# EAGLE schematic 4 Strain Gauge Board (EAGLE 9.1.3)
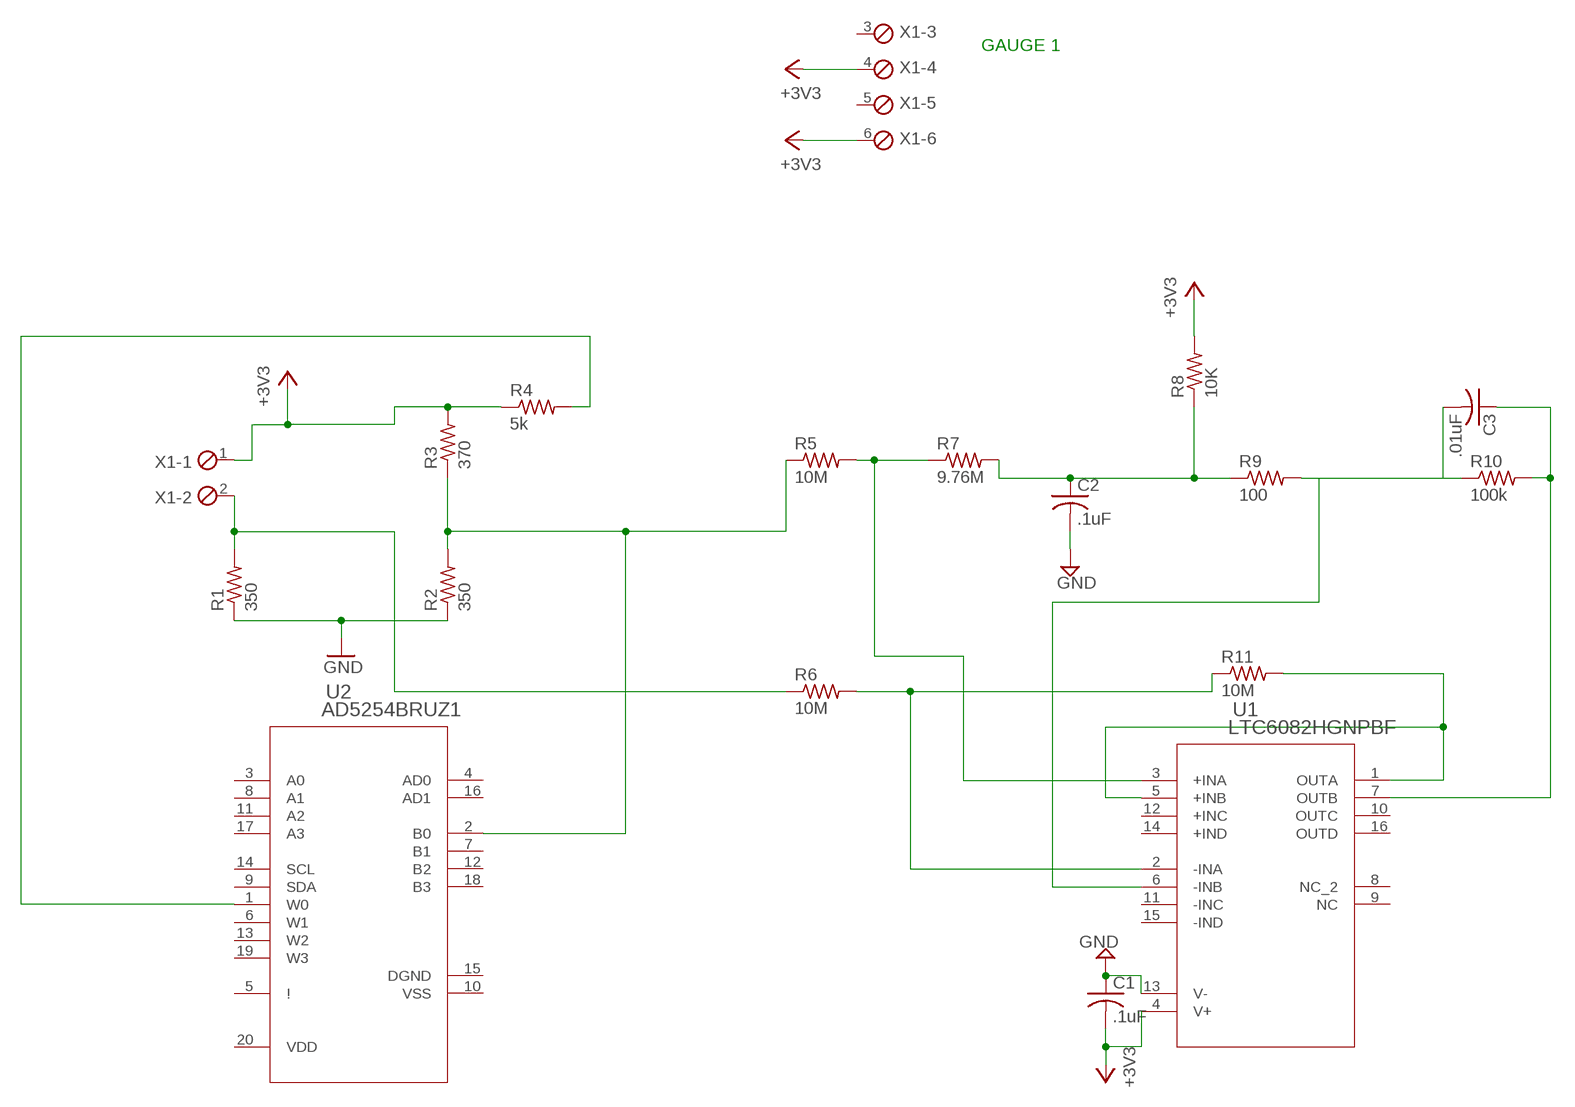
[diagram p0: schematic, sheet 1]

## Parts
C1  .1uF  C-USC1206K  [C1206K]
C2  .1uF  C-USC1206K  [C1206K]
C3  .01uF  C-USC1206K  [C1206K]
R1  350  R-US_M1206  [M1206]
R2  350  R-US_M1206  [M1206]
R3  370  R-US_M1206  [M1206]
R4  5k  R-US_M1206  [M1206]
R5  10M  R-US_M1206  [M1206]
R6  10M  R-US_M1206  [M1206]
R7  9.76M  R-US_M1206  [M1206]
R8  10K  R-US_M1206  [M1206]
R9  100  R-US_M1206  [M1206]
R10  100k  R-US_M1206  [M1206]
R11  10M  R-US_M1206  [M1206]
U1  LTC6082HGNPBF  [SSOP-16_GN]
U2  AD5254BRUZ1  [RU_20]
X1  MPT6  [6POL254]

## Nets
+3V3: C1.2 R3.2 R4.1 R8.2 U1.4(V+) X1.1 X1.4 X1.6
GND: C1.1 C2.2 R1.1 R2.1 U1.13(V-)
N$1: R2.2 R3.1 R5.1 U2.2(B0)
N$2: R1.2 R6.1 X1.2
N$3: R6.2 R11.1 U1.2(-INA)
N$4: R11.2 U1.1(OUTA) U1.5(+INB)
N$5: R4.2 U2.1(W0)
N$6: R5.2 R7.1 U1.3(+INA)
N$7: C2.1 R7.2 R8.1 R9.1
N$8: C3.2 R9.2 R10.1 U1.6(-INB)
N$9: C3.1 R10.2 U1.7(OUTB)
Unconnected: U1.8(NC_2) U1.9(NC) U1.10(OUTC) U1.11(-INC) U1.12(+INC) U1.14(+IND) U1.15(-IND) U1.16(OUTD) U2.3(A0) U2.4(AD0) U2.5(!) U2.6(W1) U2.7(B1) U2.8(A1) U2.9(SDA) U2.11(A2) U2.12(B2) U2.13(W2) U2.14(SCL) U2.15(DGND) U2.16(AD1) U2.17(A3) U2.18(B3) U2.19(W3) X1.3 X1.5

## Notes on the sheet
- GAUGE 1

## Power pins joined to a net without a drawn wire
VDD: U2.20(VDD)
VSS: U2.10(VSS)

## Library data of the parts
C1-C3 = resistor:C-US: CAPACITOR, American symbol
R1-R11 = resistor:R-US_: RESISTOR, American symbol
U1 = LTC6082 Strain Gauge Amplifier:LTC6082HGNPBF; MANUFACTURER_PART_NUMBER: LTC6082HGN#PBF; VENDOR: Linear Technology
U2 = AD5254 4x1k Digital Potentiometer:AD5254BRUZ1; MANUFACTURER_PART_NUMBER: AD5254BRUZ1; VENDOR: Analog Devices Inc
X1 = con-phoenix-254:MPT6: PHOENIX CONNECTOR; OC_FARNELL: unknown; OC_NEWARK: unknown